# Altium schematic sheet Block Diagram.SchDoc
size A3; CheckedBy: deneme; DocumentNumber: 2; SheetNumber: 2; SheetTotal: 5; ProjectDescription: Wireless Security Detector; ProjectUnit: mm
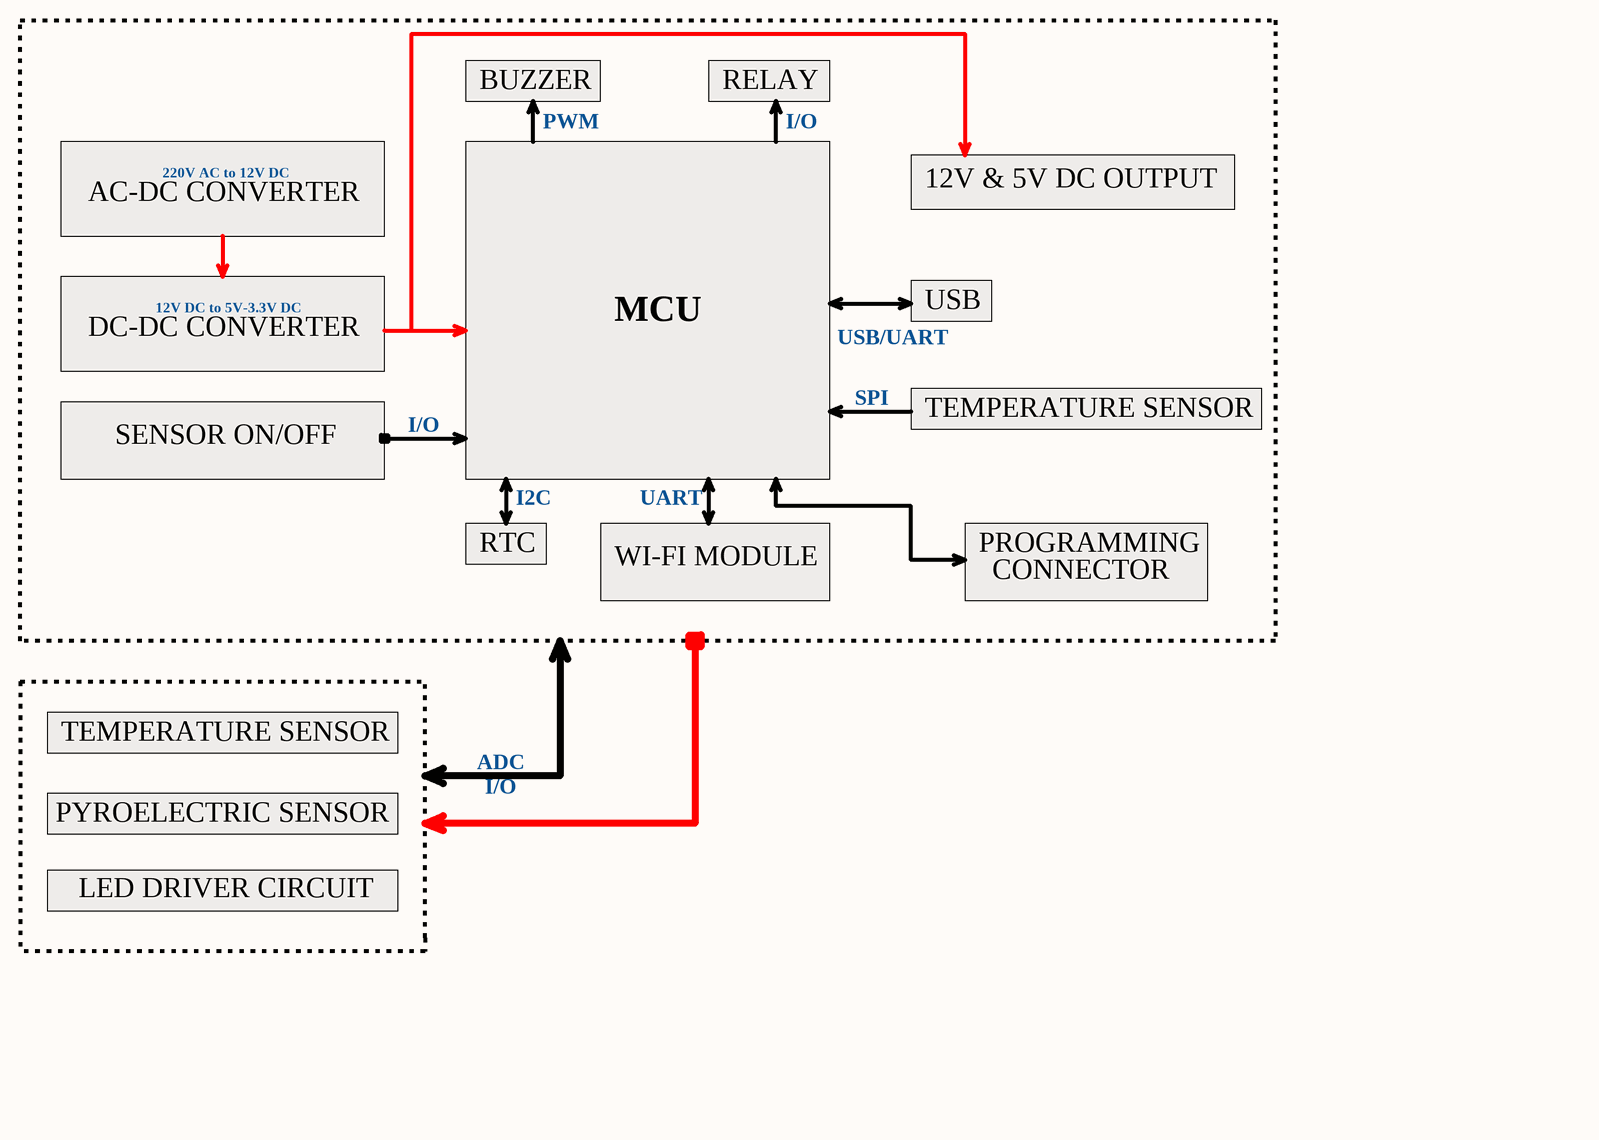
[diagram p0: Block Diagram.SchDoc]

## Notes on the sheet
- BUZZER
- PWM
- RELAY
- I/O
- AC-DC CONVERTER
- 220V AC to 12V DC
- 12V & 5V DC OUTPUT
- DC-DC CONVERTER
- 12V DC to 5V-3.3V DC
- MCU
- USB/UART
- USB
- SPI
- TEMPERATURE SENSOR
- SENSOR ON/OFF
- RTC
- I2C
- UART
- PROGRAMMING
- WI-FI MODULE
- CONNECTOR
- FUSE: 3413.0216.22
  BUCK CAPACITOR: ESH477M050AH4AA
  ZERO OHM RESISTOR: RC0603JR-070RL
  CERAMIC CAPACITORS:
  CL21A475KAQNNNE
  CL21B104KBCNNNC
  0603B103K160CT
  ALUMINUM CAPACITOR:
  EEV686M035A9HAA
  ZENER DIODE: 1SMB5919BT3G
  12V,5V DC CONNECTOR: PJ-037AH-SMT-TR
  TERMINAL BLOCK: TBP01R1-508-02BE
  PROGRAMMING CONNECTOR: SMH-105-02-L-S
  DIODE FOR RELAY: 1N4148WS
  TRANSISTOR FOR RELAY (NPN): MMBT3904-7-F
  MICRO B USB CONNECTOR:
  10118192-0001LF
  CONNECTOR: 64800611622
  CRYSTALS:
  ABS05-32.768KHZ-T
  ECS-160-20-30B-TR
  LOAD CAP FOR CRYSTALS:
  CL10C200JB8NNNC
  USB PROTECTION (TVS): USBLC6-2SC6
  IC FOR PIR SENSOR: NCS36000DRG
  RESISTORS FOR IC PIR:
  RC0603JR-07560RL
  RC0603JR-07220KL
  RC0603FR-0743KL
  CAPACITORS FOR IC PIR:
  C3216X5R1E336M160AC
  RED LED (FOR SECURITY CAM LOOK): 150080RS75000
  GREEN LED: 150080GS75000
  OPAMP: OPA314AIDBVR
- PYROELECTRIC SENSOR
- ADC
- LED DRIVER CIRCUIT
- HABERLEŞME PROTOKOLLERİ:
  UART
  USART
  I2C
  SPI
- KOMPONENTLER:
  RTC: M41T00M6F
  WIFI MODULE: ESP32-WROOM-32E-N4
  PYROSENSOR: LHI 878/3902
  TEMPERATURE OUTSIDE: TFPT1206L1002FM
  TEMPERATURE INSIDE: MAX6662MSA+
  MCU: STM32F103C6T6A
  RELAY: ALQ112
  BUZZER: CMI-9605IC-0580T
  SENSOR ON/OFF: EG1215AA
  AC-DC CONVERTER:
  TRAFO: BV302S12010-ZU
  RECTIFIER: DB105STR
  DC-DC CONVERTER:
  5V DC: LM2675MX-12/NOPB
  3.3V DC: AP7361-33E-13
  LED DRIVER MOSFET:SSM3K376R,LF
- RESISTORS:
  RC0603FR-0710KL
  RC0603JR-0715RL
  CAPACITORS:
  C0603C104K4RACTU
  ALA7DA471CF450
  PCR1E471MCL1GS
- File Name:
- Prepared:
- Size:
- Description:
- Unit:
- A3
- Released:
- Edited:
- Revision:
- Checked:
- Department:
- Approved:
- Sheet: